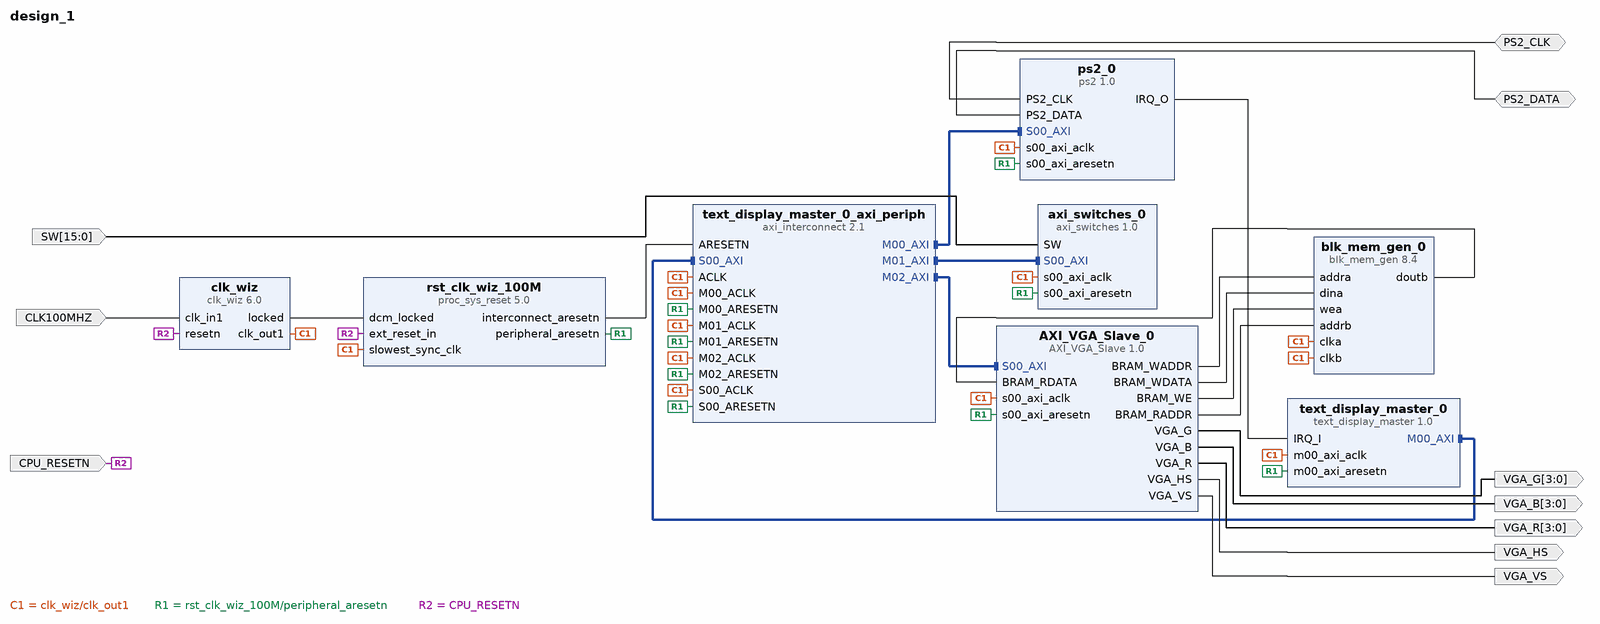
[diagram p0: block diagram of the top level]
# Vivado block design design_1, xc7a100tcsg324-1, Vivado 2018.3
create_bd_design design_1

create_bd_port -dir O -from 3 -to 0 VGA_G
create_bd_port -dir O -from 3 -to 0 VGA_R
create_bd_port -dir O -from 3 -to 0 VGA_B
create_bd_port -dir O VGA_HS
create_bd_port -dir O VGA_VS
create_bd_port -dir I -from 15 -to 0 SW
create_bd_port -dir I -type rst CPU_RESETN
set_property -dict {CONFIG.POLARITY ACTIVE_LOW} [get_bd_ports CPU_RESETN]
create_bd_port -dir I -type clk CLK100MHZ
set_property -dict {CONFIG.FREQ_HZ 100000000} [get_bd_ports CLK100MHZ]
create_bd_port -dir IO -type clk PS2_CLK
set_property -dict {CONFIG.FREQ_HZ 100000000} [get_bd_ports PS2_CLK]
create_bd_port -dir IO PS2_DATA

create_bd_cell -type ip -vlnv xilinx.com:user:ps2:1.0 ps2_0
create_bd_cell -type ip -vlnv xilinx.com:user:axi_switches:1.0 axi_switches_0
create_bd_cell -type ip -vlnv xilinx.com:ip:blk_mem_gen:8.4 blk_mem_gen_0
set_property -dict [list \
  CONFIG.Enable_32bit_Address false \
  CONFIG.Enable_A Always_Enabled \
  CONFIG.Enable_B Always_Enabled \
  CONFIG.Memory_Type Simple_Dual_Port_RAM \
  CONFIG.Operating_Mode_A NO_CHANGE \
  CONFIG.Port_B_Clock 100 \
  CONFIG.Port_B_Enable_Rate 100 \
  CONFIG.Read_Width_B 32 \
  CONFIG.Register_PortB_Output_of_Memory_Primitives true \
  CONFIG.Use_Byte_Write_Enable false \
  CONFIG.Write_Depth_A 38400 \
  CONFIG.Write_Width_A 32 \
  CONFIG.Write_Width_B 32 \
  CONFIG.use_bram_block Stand_Alone \
] [get_bd_cells blk_mem_gen_0]
create_bd_cell -type ip -vlnv xilinx.com:ip:axi_interconnect:2.1 text_display_master_0_axi_periph
set_property -dict {CONFIG.NUM_MI 3} [get_bd_cells text_display_master_0_axi_periph]
create_bd_cell -type ip -vlnv xilinx.com:ip:clk_wiz:6.0 clk_wiz
set_property -dict [list \
  CONFIG.CLKOUT1_JITTER 151.636 \
  CONFIG.CLKOUT1_REQUESTED_OUT_FREQ 50.000 \
  CONFIG.MMCM_CLKOUT0_DIVIDE_F 20.000 \
  CONFIG.MMCM_DIVCLK_DIVIDE 1 \
  CONFIG.RESET_PORT resetn \
  CONFIG.RESET_TYPE ACTIVE_LOW \
] [get_bd_cells clk_wiz]
create_bd_cell -type ip -vlnv xilinx.com:ip:proc_sys_reset:5.0 rst_clk_wiz_100M
create_bd_cell -type ip -vlnv xilinx.com:user:AXI_VGA_Slave:1.0 AXI_VGA_Slave_0
create_bd_cell -type ip -vlnv xilinx.com:user:text_display_master:1.0 text_display_master_0

# ---- connections ----

connect_bd_intf_net [get_bd_intf_pins text_display_master_0_axi_periph/M02_AXI] [get_bd_intf_pins AXI_VGA_Slave_0/S00_AXI]
connect_bd_intf_net [get_bd_intf_pins text_display_master_0_axi_periph/M00_AXI] [get_bd_intf_pins ps2_0/S00_AXI]
connect_bd_intf_net [get_bd_intf_pins text_display_master_0_axi_periph/M01_AXI] [get_bd_intf_pins axi_switches_0/S00_AXI]
connect_bd_intf_net [get_bd_intf_pins text_display_master_0/M00_AXI] [get_bd_intf_pins text_display_master_0_axi_periph/S00_AXI]
connect_bd_net [get_bd_pins AXI_VGA_Slave_0/VGA_G] [get_bd_ports VGA_G]
connect_bd_net [get_bd_pins AXI_VGA_Slave_0/VGA_R] [get_bd_ports VGA_R]
connect_bd_net [get_bd_pins AXI_VGA_Slave_0/VGA_B] [get_bd_ports VGA_B]
connect_bd_net [get_bd_pins AXI_VGA_Slave_0/VGA_HS] [get_bd_ports VGA_HS]
connect_bd_net [get_bd_pins AXI_VGA_Slave_0/VGA_VS] [get_bd_ports VGA_VS]
connect_bd_net [get_bd_ports SW] [get_bd_pins axi_switches_0/SW]
connect_bd_net [get_bd_pins AXI_VGA_Slave_0/BRAM_WADDR] [get_bd_pins blk_mem_gen_0/addra]
connect_bd_net [get_bd_pins AXI_VGA_Slave_0/BRAM_WDATA] [get_bd_pins blk_mem_gen_0/dina]
connect_bd_net [get_bd_pins AXI_VGA_Slave_0/BRAM_WE] [get_bd_pins blk_mem_gen_0/wea]
connect_bd_net [get_bd_pins AXI_VGA_Slave_0/BRAM_RADDR] [get_bd_pins blk_mem_gen_0/addrb]
connect_bd_net [get_bd_pins blk_mem_gen_0/doutb] [get_bd_pins AXI_VGA_Slave_0/BRAM_RDATA]
connect_bd_net [get_bd_pins clk_wiz/clk_out1] \
  [get_bd_pins text_display_master_0_axi_periph/S00_ACLK] [get_bd_pins ps2_0/s00_axi_aclk] \
  [get_bd_pins text_display_master_0_axi_periph/M00_ACLK] [get_bd_pins axi_switches_0/s00_axi_aclk] \
  [get_bd_pins text_display_master_0_axi_periph/M01_ACLK] [get_bd_pins text_display_master_0_axi_periph/M02_ACLK] \
  [get_bd_pins blk_mem_gen_0/clka] [get_bd_pins blk_mem_gen_0/clkb] [get_bd_pins text_display_master_0_axi_periph/ACLK] \
  [get_bd_pins rst_clk_wiz_100M/slowest_sync_clk] [get_bd_pins AXI_VGA_Slave_0/s00_axi_aclk] \
  [get_bd_pins text_display_master_0/m00_axi_aclk]
connect_bd_net [get_bd_pins clk_wiz/locked] [get_bd_pins rst_clk_wiz_100M/dcm_locked]
connect_bd_net [get_bd_pins rst_clk_wiz_100M/peripheral_aresetn] \
  [get_bd_pins text_display_master_0_axi_periph/S00_ARESETN] [get_bd_pins ps2_0/s00_axi_aresetn] \
  [get_bd_pins text_display_master_0_axi_periph/M00_ARESETN] [get_bd_pins axi_switches_0/s00_axi_aresetn] \
  [get_bd_pins text_display_master_0_axi_periph/M01_ARESETN] [get_bd_pins text_display_master_0_axi_periph/M02_ARESETN] \
  [get_bd_pins AXI_VGA_Slave_0/s00_axi_aresetn] [get_bd_pins text_display_master_0/m00_axi_aresetn]
connect_bd_net [get_bd_ports CPU_RESETN] [get_bd_pins clk_wiz/resetn] [get_bd_pins rst_clk_wiz_100M/ext_reset_in]
connect_bd_net [get_bd_ports CLK100MHZ] [get_bd_pins clk_wiz/clk_in1]
connect_bd_net [get_bd_pins ps2_0/IRQ_O] [get_bd_pins text_display_master_0/IRQ_I]
connect_bd_net [get_bd_ports PS2_CLK] [get_bd_pins ps2_0/PS2_CLK]
connect_bd_net [get_bd_ports PS2_DATA] [get_bd_pins ps2_0/PS2_DATA]
connect_bd_net [get_bd_pins rst_clk_wiz_100M/interconnect_aresetn] [get_bd_pins text_display_master_0_axi_periph/ARESETN]

# ---- address map ----
assign_bd_address -offset 0x40000000 -range 64K -target_address_space [get_bd_addr_spaces text_display_master_0/M00_AXI] [get_bd_addr_segs axi_switches_0/S00_AXI/S00_AXI_reg]
assign_bd_address -offset 0x80000000 -range 64K -target_address_space [get_bd_addr_spaces text_display_master_0/M00_AXI] [get_bd_addr_segs ps2_0/S00_AXI/S00_AXI_reg]
assign_bd_address -offset 0xC0000000 -range 64K -target_address_space [get_bd_addr_spaces text_display_master_0/M00_AXI] [get_bd_addr_segs AXI_VGA_Slave_0/S00_AXI/S00_AXI_reg]

validate_bd_design
save_bd_design
